# EAGLE board ComputeCalculator_V1_0 (EAGLE 7.1.0)
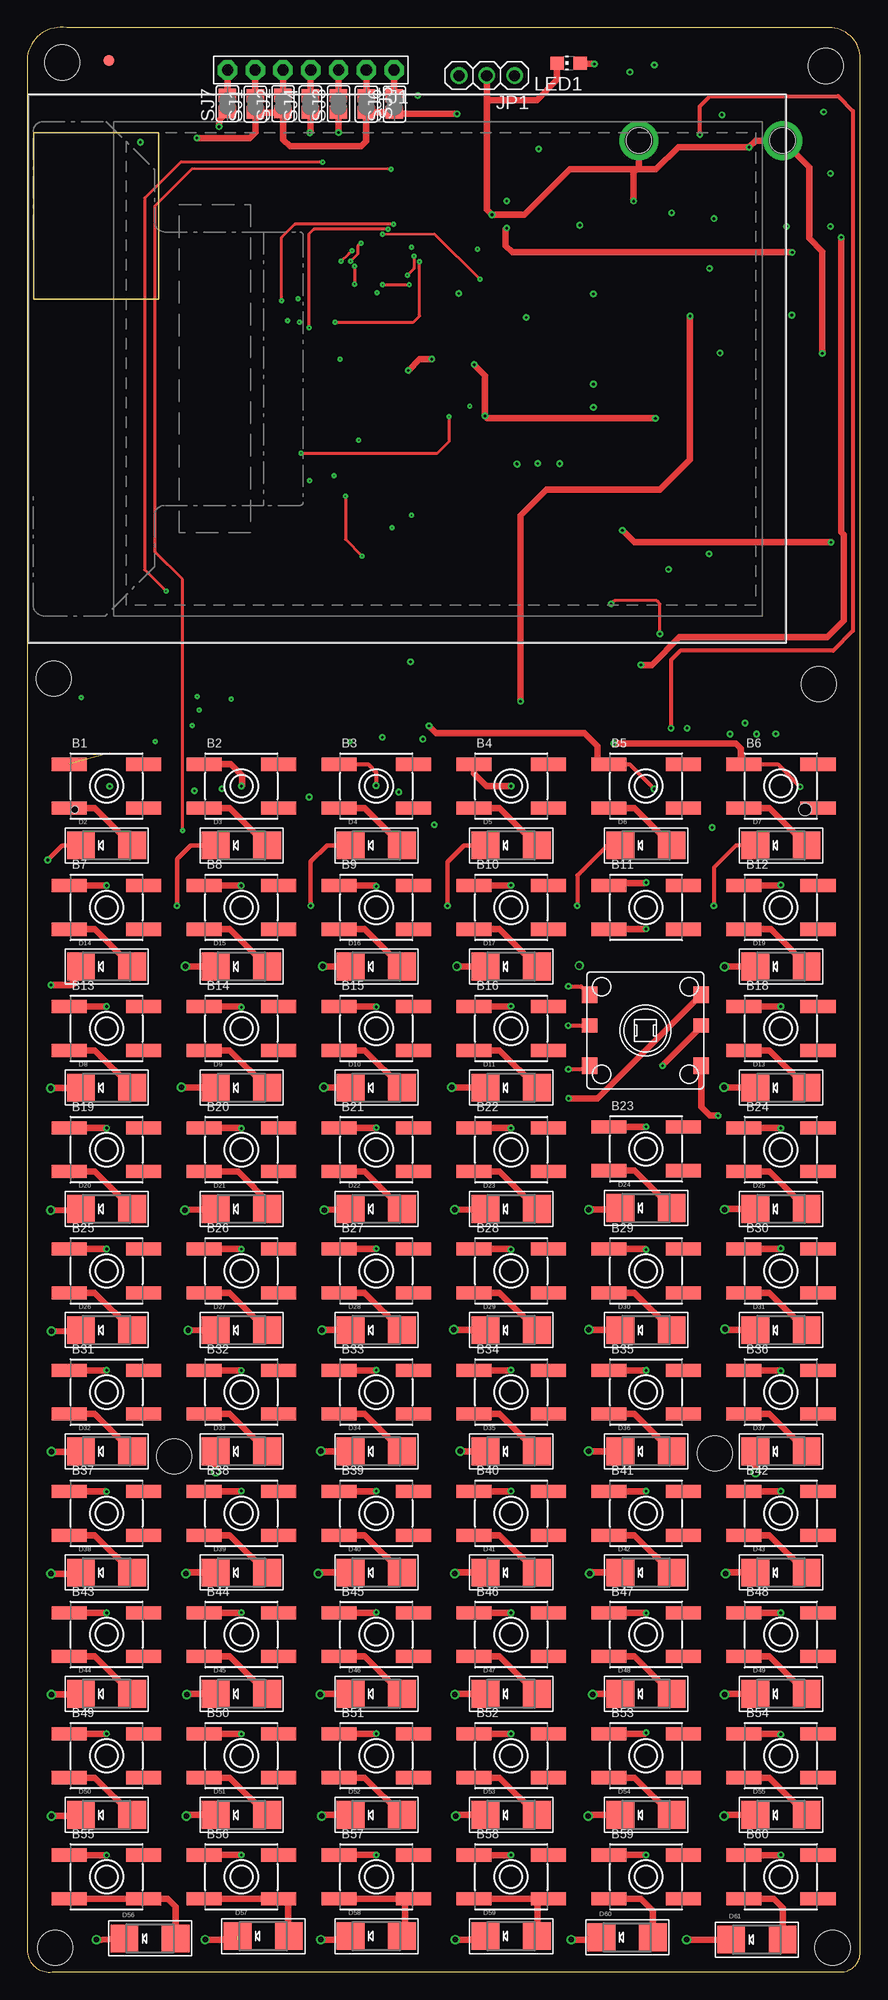
[diagram p5: board, top side]
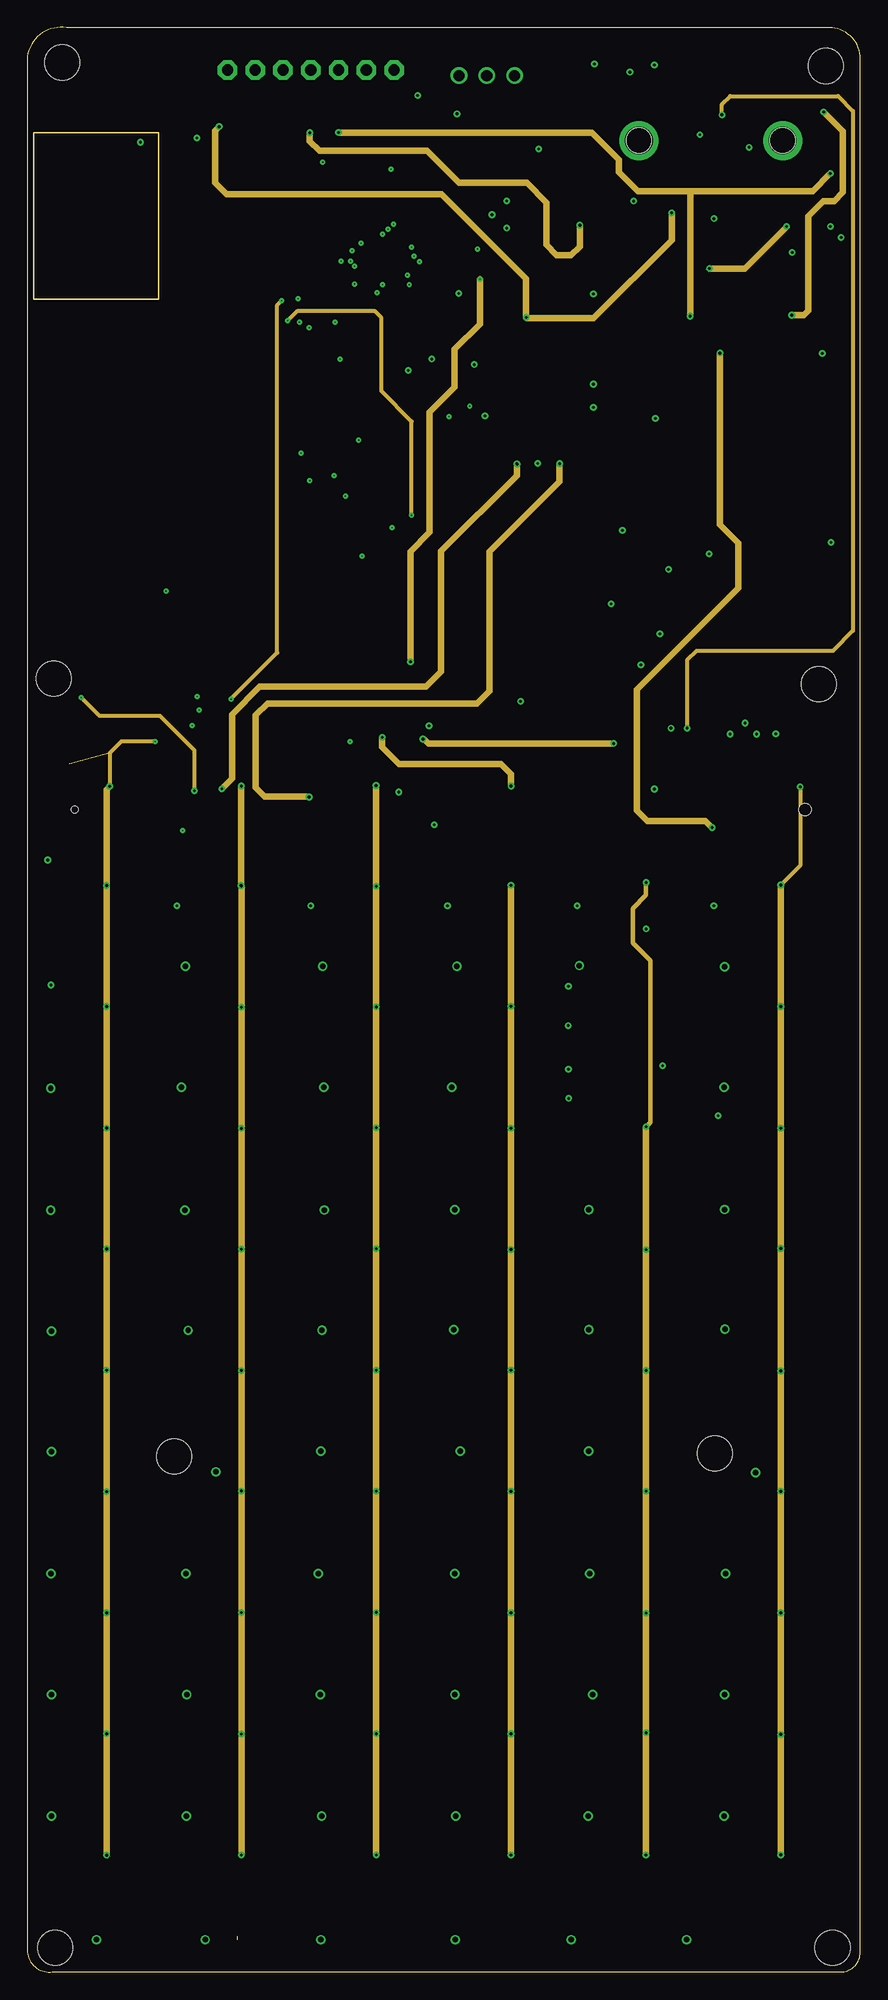
[diagram p6: board, inner layer Route3]
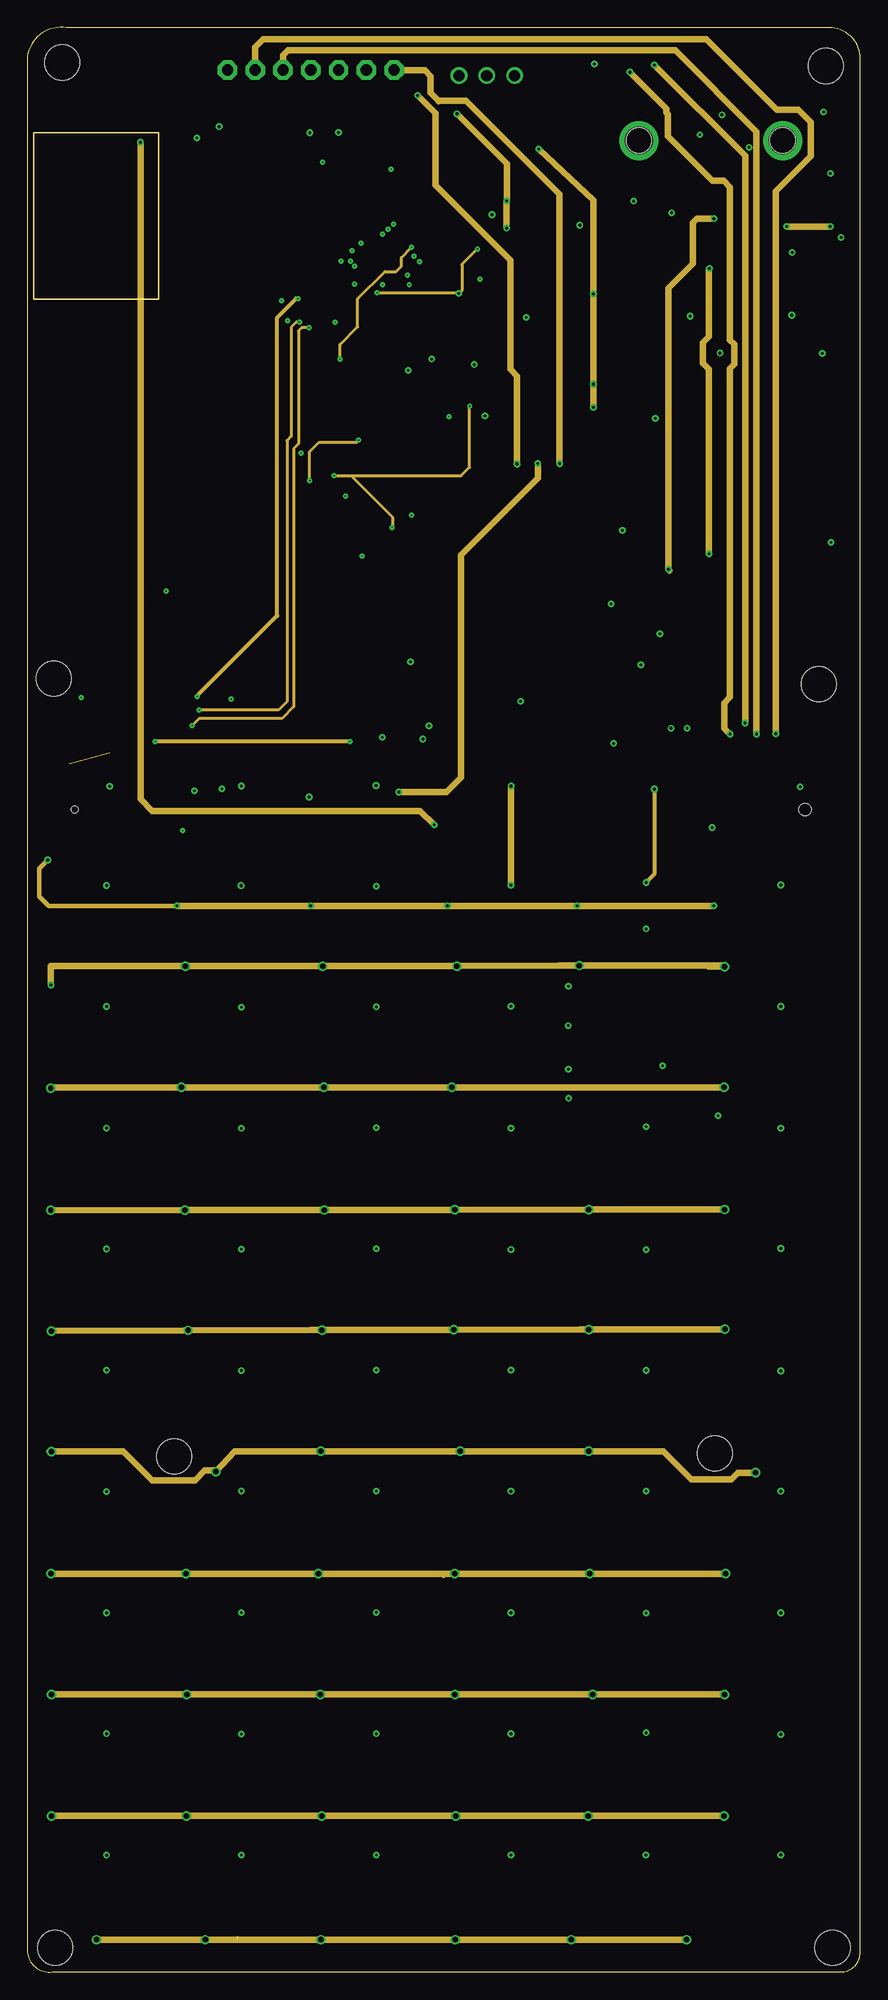
[diagram p7: board, inner layer Route4]
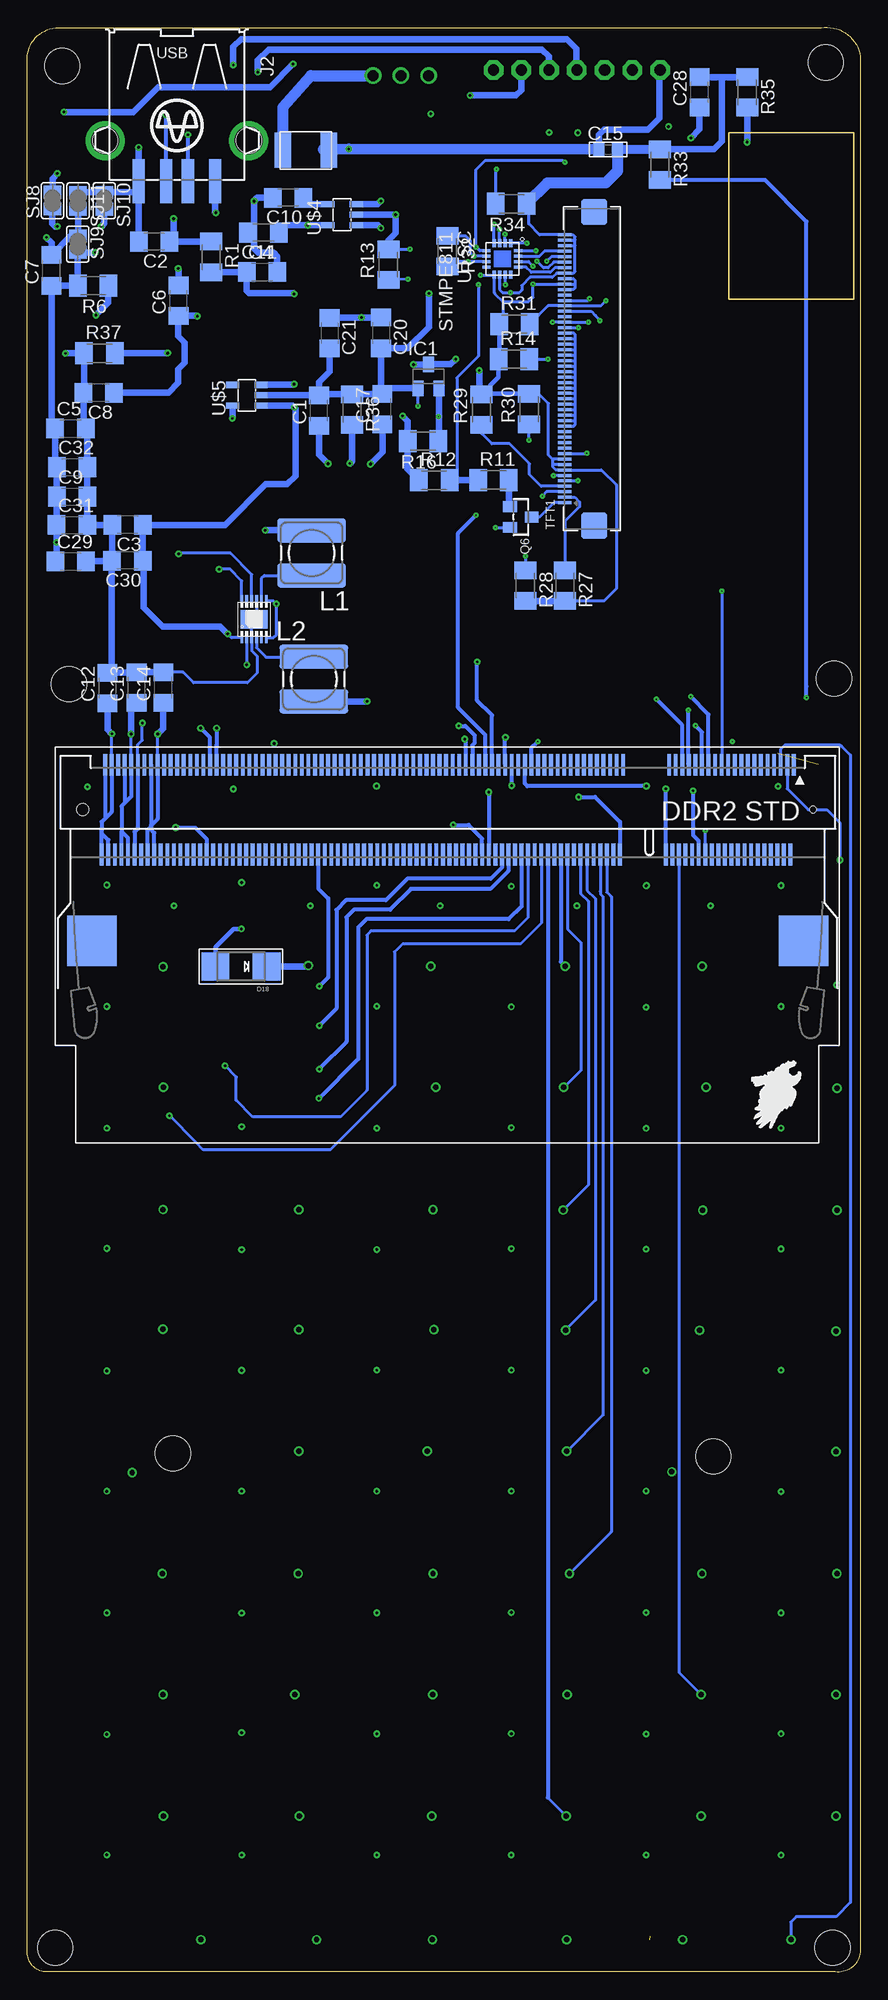
[diagram p8: board, bottom side, seen from below]

Size 76.2 x 177.85 mm. Coordinates in mm from the lower left corner, seen from the top.
Outline: 73.36,177.81 3.59,177.81 arc90 0,175.22 0,1.8 arc90 2.29,0.01 74.4,0.01 arc90 76.2,1.81 76.2,174.97 arc90 73.36,177.81
Copper layers (1*3*4*16): Top 0.0356mm / dielectric 0.5mm / Route3 0.0356mm / dielectric 0.5mm / Route4 0.0356mm / dielectric 0.5mm / Bottom 0.0356mm
Design rules "OSHPARK_LaenPCBOrder *": minimum track width 6mil, minimum drill 13mil, track to track 6mil, track to pad 6mil, pad to pad 6mil, via to via 6mil, smd to smd 6mil, copper to edge 15mil, drill to drill 6mil, minimum pad ring 7mil, minimum via ring 7mil, stop-mask expansion 3mil, vias tented up to drill 0mil, thermal gap 10mil
Holes 3.2 mm at 3.17,174.64 73.03,174.32 2.54,2.24 73.66,2.24 2.4,118.31 13.44,47.16 62.88,47.43 72.39,117.81

## Footprints (pad centres in the part's own frame; a part is rotated, then mirrored left to right if it is on the bottom)
EVQ-Q2 = smd 3.2 x 1.2: A -3.4,-2; A' 3.4,-2; B -3.4,2; B' 3.4,2
SKQU = smd 1.4 x 1.5: 1 -5.1,3.25; 3 -5.1,-3.25; 4 5.1,-3.25; 6 5.1,3.25 | smd 1.4 x 1.3: 2 -5.1,-0.45; 5 5.1,-0.45
C1206 = smd 1.6 x 1.8: 1 -1.4,0; 2 1.4,0
C0603 = smd 1 x 1.1: 1 -0.85,0; 2 0.85,0
SMADIODE = smd 2.54 x 2.54: A 2.349,0; C -2.349,0
SOT23 = smd 1 x 1.4: 1 -0.95,-1.1; 2 0.95,-1.1; 3 0,1.1
1X7-BIG = drill 1.016 pad 1.778 octagon: 1 -7.62,0; 2 -5.08,0; 3 -2.54,0; 4 0,0; 5 2.54,0; 6 5.08,0; 7 7.62,0
USB-A003 = smd 1.12 x 4: 1 -3.5,14; 2 -1,14; 3 1,14; 4 3.5,14 | hole 2.3: -6.57,10.28; 6.57,10.28
1X03 = drill 1.016: 1 -2.54,0; 2 0,0; 3 2.54,0
POWER-CHOKE_WE-TPC = smd 6.3 x 2.2: 1 0,2.05; 2 0,-2.05
CHIP-LED0805 = smd 1.2 x 1.2: A 0,-1.05; C 0,1.05
RPI_COMPUTE = smd 0.35 x 2: 1 -31.38,-4.1; 2 -31.08,4.1; 3 -30.78,-4.1; 4 -30.48,4.1; 5 -30.18,-4.1; 6 -29.88,4.1; 7 -29.58,-4.1; 8 -29.28,4.1; 9 -28.98,-4.1; 10 -28.68,4.1; 11 -28.38,-4.1; 12 -28.08,4.1; 13 -27.78,-4.1; 14 -27.48,4.1; 15 -27.18,-4.1; 16 -26.88,4.1; 17 -26.58,-4.1; 18 -26.28,4.1; 19 -25.98,-4.1; 20 -25.68,4.1; 21 -25.38,-4.1; 22 -25.08,4.1; 23 -24.78,-4.1; 24 -24.48,4.1; 25 -24.18,-4.1; 26 -23.88,4.1; 27 -23.58,-4.1; 28 -23.28,4.1; 29 -22.98,-4.1; 30 -22.68,4.1; 31 -22.38,-4.1; 32 -22.08,4.1; 33 -21.78,-4.1; 34 -21.48,4.1; 35 -21.18,-4.1; 36 -20.88,4.1; 37 -20.58,-4.1; 38 -20.28,4.1; 39 -19.98,-4.1; 40 -19.68,4.1; 41 -15.78,-4.1; 42 -15.48,4.1; 43 -15.18,-4.1; 44 -14.88,4.1; 45 -14.58,-4.1; 46 -14.28,4.1; 47 -13.98,-4.1; 48 -13.68,4.1; 49 -13.38,-4.1; 50 -13.08,4.1; 51 -12.78,-4.1; 52 -12.48,4.1; 53 -12.18,-4.1; 54 -11.88,4.1; 55 -11.58,-4.1; 56 -11.28,4.1; 57 -10.98,-4.1; 58 -10.68,4.1; 59 -10.38,-4.1; 60 -10.08,4.1; 61 -9.78,-4.1; 62 -9.48,4.1; 63 -9.18,-4.1; 64 -8.88,4.1; 65 -8.58,-4.1; 66 -8.28,4.1; 67 -7.98,-4.1; 68 -7.68,4.1; 69 -7.38,-4.1; 70 -7.08,4.1; 71 -6.78,-4.1; 72 -6.48,4.1; 73 -6.18,-4.1; 74 -5.88,4.1; 75 -5.58,-4.1; 76 -5.28,4.1; 77 -4.98,-4.1; 78 -4.68,4.1; 79 -4.38,-4.1; 80 -4.08,4.1; 81 -3.78,-4.1; 82 -3.48,4.1; 83 -3.18,-4.1; 84 -2.88,4.1; 85 -2.58,-4.1; 86 -2.28,4.1; 87 -1.98,-4.1; 88 -1.68,4.1; 89 -1.38,-4.1; 90 -1.08,4.1; 91 -0.78,-4.1; 92 -0.48,4.1; 93 -0.18,-4.1; 94 0.12,4.1; 95 0.42,-4.1; 96 0.72,4.1; 97 1.02,-4.1; 98 1.32,4.1; 99 1.62,-4.1; 100 1.92,4.1; 101 2.22,-4.1; 102 2.52,4.1; 103 2.82,-4.1; 104 3.12,4.1; 105 3.42,-4.1; 106 3.72,4.1; 107 4.02,-4.1; 108 4.32,4.1; 109 4.62,-4.1; 110 4.92,4.1; 111 5.22,-4.1; 112 5.52,4.1; 113 5.82,-4.1; 114 6.12,4.1; 115 6.42,-4.1; 116 6.72,4.1; 117 7.02,-4.1; 118 7.32,4.1; 119 7.62,-4.1; 120 7.92,4.1; 121 8.22,-4.1; 122 8.52,4.1; 123 8.82,-4.1; 124 9.12,4.1; 125 9.42,-4.1; 126 9.72,4.1; 127 10.02,-4.1; 128 10.32,4.1; 129 10.62,-4.1; 130 10.92,4.1; 131 11.22,-4.1; 132 11.52,4.1; 133 11.82,-4.1; 134 12.12,4.1; 135 12.42,-4.1; 136 12.72,4.1; 137 13.02,-4.1; 138 13.32,4.1; 139 13.62,-4.1; 140 13.92,4.1; 141 14.22,-4.1; 142 14.52,4.1; 143 14.82,-4.1; 144 15.12,4.1; 145 15.42,-4.1; 146 15.72,4.1; 147 16.02,-4.1; 148 16.32,4.1; 149 16.62,-4.1; 150 16.92,4.1; 151 17.22,-4.1; 152 17.52,4.1; 153 17.82,-4.1; 154 18.12,4.1; 155 18.42,-4.1; 156 18.72,4.1; 157 19.02,-4.1; 158 19.32,4.1; 159 19.62,-4.1; 160 19.92,4.1; 161 20.22,-4.1; 162 20.52,4.1; 163 20.82,-4.1; 164 21.12,4.1; 165 21.42,-4.1; 166 21.72,4.1; 167 22.02,-4.1; 168 22.32,4.1; 169 22.62,-4.1; 170 22.92,4.1; 171 23.22,-4.1; 172 23.52,4.1; 173 23.82,-4.1; 174 24.12,4.1; 175 24.42,-4.1; 176 24.72,4.1; 177 25.02,-4.1; 178 25.32,4.1; 179 25.62,-4.1; 180 25.92,4.1; 181 26.22,-4.1; 182 26.52,4.1; 183 26.82,-4.1; 184 27.12,4.1; 185 27.42,-4.1; 186 27.72,4.1; 187 28.02,-4.1; 188 28.32,4.1; 189 28.62,-4.1; 190 28.92,4.1; 191 29.22,-4.1; 192 29.52,4.1; 193 29.82,-4.1; 194 30.12,4.1; 195 30.42,-4.1; 196 30.72,4.1; 197 31.02,-4.1; 198 31.32,4.1; 199 31.62,-4.1; 200 31.92,4.1 | smd 4.5 x 4.6: M1 -32.28,12; M2 32.82,12 | hole 0.6: -33.13,0 | hole 1.1: 33.67,0
SOT23-WIDE = smd 1 x 1.27: 1 -0.95,-1; 2 0.95,-1; 3 0,1
M1206 = smd 1.6 x 2: 1 -1.4,0; 2 1.4,0
SJW = smd 1.168 x 1.6: 1 -0.762,0; 2 0.762,0
TFT_2.83IN_240X320_50PIN = smd 0.275 x 1.2 bottom: 1 12.25,-10.39; 2 11.75,-10.39; 3 11.25,-10.39; 4 10.75,-10.39; 5 10.25,-10.39; 6 9.75,-10.39; 7 9.25,-10.39; 8 8.75,-10.39; 9 8.25,-10.39; 10 7.75,-10.39; 11 7.25,-10.39; 12 6.75,-10.39; 13 6.25,-10.39; 14 5.75,-10.39; 15 5.25,-10.39; 16 4.75,-10.39; 17 4.25,-10.39; 18 3.75,-10.39; 19 3.25,-10.39; 20 2.75,-10.39; 21 2.25,-10.39; 22 1.75,-10.39; 23 1.25,-10.39; 24 0.75,-10.39; 25 0.25,-10.39; 26 -0.25,-10.39; 27 -0.75,-10.39; 28 -1.25,-10.39; 29 -1.75,-10.39; 30 -2.25,-10.39; 31 -2.75,-10.39; 32 -3.25,-10.39; 33 -3.75,-10.39; 34 -4.25,-10.39; 35 -4.75,-10.39; 36 -5.25,-10.39; 37 -5.75,-10.39; 38 -6.25,-10.39; 39 -6.75,-10.39; 40 -7.25,-10.39; 41 -7.75,-10.39; 42 -8.25,-10.39; 43 -8.75,-10.39; 44 -9.25,-10.39; 45 -9.75,-10.39; 46 -10.25,-10.39; 47 -10.75,-10.39; 48 -11.25,-10.39; 49 -11.75,-10.39; 50 -12.25,-10.39 | smd 2.4 x 2.4 bottom: PAD1 14.35,-13.09; PAD2 -14.35,-13.09
WDFN_12L = smd 1 x 0.25: 1 -1.7,1.125; 2 -1.7,0.675; 3 -1.7,0.225; 4 -1.7,-0.225; 5 -1.7,-0.675; 6 -1.7,-1.125; 7 1.7,-1.125; 8 1.7,-0.675; 9 1.7,-0.225; 10 1.7,0.225; 11 1.7,0.675; 12 1.7,1.125 | smd 1.7 x 2.5: 13 0,0
FIDUCIAL_1MM = smd 1 x 1: 1 0,0
MF-MSMF200 = smd 1.5 x 3.2: P$1 -2.1,0; P$2 2.1,0
SOT-25 = smd 0.55 x 1.2: 1 -0.95,-1.3; 2 0,-1.3; 3 0.95,-1.3; 4 0.95,1.3; 5 -0.95,1.3
QFN16L = smd 0.75 x 0.3: 1 -1.45,0.75; 2 -1.45,0.25; 3 -1.45,-0.25; 4 -1.45,-0.75; 9 1.45,-0.75; 10 1.45,-0.25; 11 1.45,0.25; 12 1.45,0.75 | smd 0.3 x 0.75: 5 -0.75,-1.45; 6 -0.25,-1.45; 7 0.25,-1.45; 8 0.75,-1.45; 13 0.75,1.45; 14 0.25,1.45; 15 -0.25,1.45; 16 -0.75,1.45

## Placement (x,y rotation side)
B1  A0  [EVQ-Q2]  7.25,108.46 0 top
B2  B0  [EVQ-Q2]  19.58,108.46 0 top
B3  C0  [EVQ-Q2]  31.92,108.46 0 top
B4  D0  [EVQ-Q2]  44.26,108.46 0 top
B5  E0  [EVQ-Q2]  56.6,108.46 0 top
B6  F0  [EVQ-Q2]  68.93,108.46 0 top
B7  A1  [EVQ-Q2]  7.25,97.38 0 top
B8  B1  [EVQ-Q2]  19.58,97.38 0 top
B9  C1  [EVQ-Q2]  31.92,97.38 0 top
B10  D1  [EVQ-Q2]  44.26,97.38 0 top
B11  E1  [EVQ-Q2]  56.6,97.38 0 top
B12  F1  [EVQ-Q2]  68.93,97.38 0 top
B13  A2  [EVQ-Q2]  7.25,86.29 0 top
B14  B2  [EVQ-Q2]  19.58,86.29 0 top
B15  C2  [EVQ-Q2]  31.92,86.29 0 top
B16  D2  [EVQ-Q2]  44.26,86.29 0 top
B17  SKQU  [SKQU]  56.53,86.12 180 top
B18  F2  [EVQ-Q2]  68.93,86.29 0 top
B19  A3  [EVQ-Q2]  7.25,75.21 0 top
B20  B3  [EVQ-Q2]  19.58,75.21 0 top
B21  C3  [EVQ-Q2]  31.92,75.21 0 top
B22  D3  [EVQ-Q2]  44.26,75.21 0 top
B23  E3  [EVQ-Q2]  56.6,75.29 0 top
B24  F3  [EVQ-Q2]  68.93,75.21 0 top
B25  A4  [EVQ-Q2]  7.25,64.13 0 top
B26  B4  [EVQ-Q2]  19.58,64.13 0 top
B27  C4  [EVQ-Q2]  31.92,64.13 0 top
B28  D4  [EVQ-Q2]  44.26,64.13 0 top
B29  E4  [EVQ-Q2]  56.6,64.13 0 top
B30  F4  [EVQ-Q2]  68.93,64.13 0 top
B31  A5  [EVQ-Q2]  7.25,53.04 0 top
B32  B5  [EVQ-Q2]  19.58,53.04 0 top
B33  C5  [EVQ-Q2]  31.92,53.04 0 top
B34  D5  [EVQ-Q2]  44.26,53.04 0 top
B35  E5  [EVQ-Q2]  56.6,53.04 0 top
B36  F5\  [EVQ-Q2]  68.93,53.04 0 top
B37  A6  [EVQ-Q2]  7.25,41.96 0 top
B38  B6  [EVQ-Q2]  19.58,41.96 0 top
B39  C6  [EVQ-Q2]  31.92,41.96 0 top
B40  D6  [EVQ-Q2]  44.26,41.96 0 top
B41  E6  [EVQ-Q2]  56.6,41.96 0 top
B42  F6  [EVQ-Q2]  68.93,41.96 0 top
B43  A7  [EVQ-Q2]  7.25,30.88 0 top
B44  B7  [EVQ-Q2]  19.58,30.88 0 top
B45  C7  [EVQ-Q2]  31.92,30.88 0 top
B46  D7  [EVQ-Q2]  44.26,30.88 0 top
B47  E7  [EVQ-Q2]  56.6,30.88 0 top
B48  F7  [EVQ-Q2]  68.93,30.88 0 top
B49  A8  [EVQ-Q2]  7.25,19.79 0 top
B50  B8  [EVQ-Q2]  19.58,19.79 0 top
B51  C8  [EVQ-Q2]  31.92,19.79 0 top
B52  D8  [EVQ-Q2]  44.26,19.79 0 top
B53  E8  [EVQ-Q2]  56.6,19.79 0 top
B54  F8  [EVQ-Q2]  68.93,19.79 0 top
B55  A9  [EVQ-Q2]  7.25,8.71 0 top
B56  B9  [EVQ-Q2]  19.58,8.71 0 top
B57  C9  [EVQ-Q2]  31.92,8.71 0 top
B58  D9  [EVQ-Q2]  44.26,8.71 0 top
B59  E9  [EVQ-Q2]  56.6,8.71 0 top
B60  F9  [EVQ-Q2]  68.93,8.71 0 top
C1  1uF  [C1206]  49.51,142.8 90 bottom
C2  100nF  [C1206]  64.61,158.25 180 bottom
C3  10uF  [C1206]  67.02,132.35 180 bottom
C4  10uF  [C1206]  54.74,155.49 0 bottom
C5  10uF  [C1206]  72.25,141.18 0 bottom
C6  NF  [C1206]  62.36,152.86 90 bottom
C7  NF  [C1206]  73.99,155.62 90 bottom
C8  10uF  [C1206]  69.66,144.42 180 bottom
C9  1uF  [C1206]  72.11,134.93 0 bottom
C10  100nF  [C1206]  52.34,162.26 180 bottom
C11  4.7uF  [C1206]  54.61,159.07 180 bottom
C12  47uF  [C1206]  68.86,117.43 90 bottom
C13  47uF  [C1206]  66.19,117.46 90 bottom
C14  47uF  [C1206]  63.76,117.47 90 bottom
C15  47uF  [C0603]  23.06,166.68 0 bottom
C17  1uF  [C1206]  43.72,142.92 90 bottom
C20  47uF  [C1206]  43.84,149.9 270 bottom
C21  47uF  [C1206]  48.55,149.89 270 bottom
C28  10uF  [C1206]  14.71,171.91 90 bottom
C29  0.1uF  [C1206]  72.22,129.02 0 bottom
C30  10uF  [C1206]  67.04,129.07 180 bottom
C31  0.1uF  [C1206]  72.12,132.34 0 bottom
C32  0.1uF  [C1206]  72.11,137.63 0 bottom
D2  [SMADIODE]  7.25,103.05 0 top
D3  [SMADIODE]  19.58,103.05 0 top
D4  [SMADIODE]  31.92,103.05 0 top
D5  [SMADIODE]  44.26,103.05 0 top
D6  [SMADIODE]  56.6,103.05 0 top
D7  [SMADIODE]  68.93,103.05 0 top
D8  [SMADIODE]  7.25,80.88 0 top
D9  [SMADIODE]  19.58,80.88 0 top
D10  [SMADIODE]  31.92,80.88 0 top
D11  [SMADIODE]  44.26,80.88 0 top
D13  [SMADIODE]  68.93,80.88 0 top
D14  [SMADIODE]  7.25,91.97 0 top
D15  [SMADIODE]  19.58,91.97 0 top
D16  [SMADIODE]  31.92,91.97 0 top
D17  [SMADIODE]  44.26,91.97 0 top
D18  [SMADIODE]  56.66,91.97 180 bottom
D19  [SMADIODE]  68.93,91.97 0 top
D20  [SMADIODE]  7.25,69.8 0 top
D21  [SMADIODE]  19.58,69.8 0 top
D22  [SMADIODE]  31.92,69.8 0 top
D23  [SMADIODE]  44.26,69.8 0 top
D24  [SMADIODE]  56.6,69.88 0 top
D25  [SMADIODE]  68.93,69.8 0 top
D26  [SMADIODE]  7.25,58.71 0 top
D27  [SMADIODE]  19.58,58.71 0 top
D28  [SMADIODE]  31.92,58.71 0 top
D29  [SMADIODE]  44.26,58.71 0 top
D30  [SMADIODE]  56.6,58.71 0 top
D31  [SMADIODE]  68.93,58.71 0 top
D32  [SMADIODE]  7.25,47.63 0 top
D33  [SMADIODE]  19.58,47.63 0 top
D34  [SMADIODE]  31.92,47.63 0 top
D35  [SMADIODE]  44.26,47.63 0 top
D36  [SMADIODE]  56.6,47.63 0 top
D37  [SMADIODE]  68.93,47.63 0 top
D38  [SMADIODE]  7.25,36.55 0 top
D39  [SMADIODE]  19.58,36.55 0 top
D40  [SMADIODE]  31.92,36.55 0 top
D41  [SMADIODE]  44.26,36.55 0 top
D42  [SMADIODE]  56.6,36.55 0 top
D43  [SMADIODE]  68.93,36.55 0 top
D44  [SMADIODE]  7.25,25.46 0 top
D45  [SMADIODE]  19.58,25.46 0 top
D46  [SMADIODE]  31.92,25.46 0 top
D47  [SMADIODE]  44.26,25.46 0 top
D48  [SMADIODE]  56.6,25.46 0 top
D49  [SMADIODE]  68.93,25.46 0 top
D50  [SMADIODE]  7.25,14.38 0 top
D51  [SMADIODE]  19.58,14.38 0 top
D52  [SMADIODE]  31.92,14.38 0 top
D53  [SMADIODE]  44.26,14.38 0 top
D54  [SMADIODE]  56.6,14.38 0 top
D55  [SMADIODE]  68.93,14.38 0 top
D56  [SMADIODE]  11.23,3.09 0 top
D57  [SMADIODE]  21.57,3.3 0 top
D58  [SMADIODE]  31.92,3.3 0 top
D59  [SMADIODE]  44.26,3.3 0 top
D60  [SMADIODE]  54.87,3.19 0 top
D61  [SMADIODE]  66.73,2.98 0 top
IC1  MAXP803  [SOT23]  39.51,145.93 0 bottom
J1  Power  [1X7-BIG]  25.93,173.95 180 top
J2  61400416021  [USB-A003]  62.51,177.78 180 bottom
JP1  [1X03]  42.03,173.44 180 top
L1  SRN4018-4R7M  [POWER-CHOKE_WE-TPC]  50.2,129.78 180 bottom
L2  SRN4018-4R7M  [POWER-CHOKE_WE-TPC]  49.99,118.25 0 bottom
LED1  RED  [CHIP-LED0805]  49.52,174.58 90 top
PCB1  RPI_COMPUTE  [RPI_COMPUTE]  37.47,106.31 180 bottom
Q6  MMBT2222  [SOT23-WIDE]  31.06,133.07 270 bottom
R1  100KΩ 1%  [M1206]  59.38,156.85 270 bottom
R6  470Ω 1%  [M1206]  70.19,154.23 180 bottom
R11  1K  [M1206]  33.56,136.45 0 bottom
R12  1K  [M1206]  38.98,136.43 0 bottom
R13  10K  [M1206]  43.17,156.16 90 bottom
R14  10K  [M1206]  31.69,147.5 0 bottom
R16  100  [M1206]  40.01,140 180 bottom
R27  100  [M1206]  27.02,126.8 270 bottom
R28  100  [M1206]  30.64,126.79 270 bottom
R29  100  [M1206]  34.66,142.88 90 bottom
R30  100  [M1206]  30.3,142.94 90 bottom
R31  22  [M1206]  31.63,150.71 0 bottom
R32  22  [M1206]  37.78,157.39 270 bottom
R33  100KΩ 1%  [M1206]  18.33,165.28 270 bottom
R34  100KΩ 1%  [M1206]  31.93,161.71 180 bottom
R35  100KΩ 1%  [M1206]  10.35,171.9 270 bottom
R36  100KΩ 1%  [M1206]  46.5,142.88 270 bottom
R37  100KΩ 1%  [M1206]  69.6,148.04 0 bottom
SJ1  [SJW]  20.85,170.83 90 top
SJ2  [SJW]  23.39,170.88 90 top
SJ3  [SJW]  28.47,170.86 90 top
SJ4  [SJW]  25.89,170.84 90 top
SJ5  [SJW]  31.01,170.83 270 top
SJ6  [SJW]  33.58,170.83 90 top
SJ7  [SJW]  18.3,170.88 90 top
SJ8  [SJW]  73.9,162 90 bottom
SJ9  [SJW]  71.58,158.02 270 bottom
SJ10  [SJW]  69.16,161.99 270 bottom
SJ11  [SJW]  71.56,161.99 270 bottom
TFT1  DISP_LCD_2.8IN_240X320_50PIN  [TFT_2.83IN_240X320_50PIN]  37.44,146.63 270 top
U$1  PAM2306AYPKE  [WDFN_12L]  55.45,123.72 90 bottom
U$2  FIDUCIAL  [FIDUCIAL_1MM]  7.47,174.81 0 top
U$3  MF-MSMF200  [MF-MSMF200]  50.72,166.59 0 bottom
U$4  AP7115-25SEG  [SOT-25]  47.41,160.71 90 bottom
U$5  MIC5225  [SOT-25]  56.13,144.2 90 bottom
UTSC  STMPE811  [QFN16L]  32.74,156.67 270 bottom

## Tracks (layer width: path | path; a pad name or v marks a point on that pad's centre or on a via)
1V8  (via drill 0.25)
  Top 0.61: SJ3.1 v28.47,168.23 | v45.12,116.22 45.12,133.2 47.48,135.56 57.86,135.56 60.62,138.32 60.62,151.42 v60.64,151.44
  Route3 0.61: v28.47,168.23 51.64,168.23 54.13,165.74 54.13,164.6 55.85,162.88 60.6,162.88 | 60.6,162.88 71.83,162.86 v73.46,164.49 | v60.64,151.44 60.64,162.84 60.6,162.88
  Bottom 0.61: v73.46,164.49 73.4,164.51 73.9,164.01 SJ8.2 | C8.1 68.23,144.45 63.29,144.45 62.4,145.34 62.4,146.6 61.81,147.19 61.81,148.99 62.41,149.59 62.41,151.41 C6.1 60.66,151.46 v60.64,151.44 | L2.2 45.14,116.2 v45.12,116.22
3V3  (via drill 0.25)
  Top 0.61: v15.5,167.73 20.33,167.73 20.86,168.26 20.86,170.06 | 20.86,170.06 SJ1.1 | 20.86,170.06 23.33,170.06 SJ2.1 23.39,167.55 24.02,166.98 30.51,166.96 30.97,167.42 30.97,170.03 SJ5.2 SJ6.1 33.71,169.94 v39.3,169.94 | v69.97,157.27 44.39,157.27 43.76,157.9 43.76,159.4 v43.85,159.49 | v73.53,130.76 55.53,130.76 v54.44,131.85
  Route4 0.61: v43.85,161.97 43.87,161.96 43.87,165.37 v39.3,169.94 | v43.85,161.98 v43.85,161.97 | v43.85,161.97 v43.85,159.49
  Bottom 0.61: C28.1 14.71,168.52 v15.5,167.73 | U$4.1 44.12,159.76 v43.85,159.49 | U$4.3 44.17,161.66 v43.85,161.98 | v69.97,157.27 69.98,157.26 SJ9.2 71.59,157.25 R6.2 C7.1 73.99,141.52 C5.1 73.65,137.77 C32.1 C9.1 C31.1 | C31.1 73.52,129.12 C29.1 | C31.1 v73.52,130.77 v73.53,130.76 | v54.44,131.85 50.22,131.85 L1.2
5V  (via drill 0.25)
  Top 0.254: v57.87,122.38 57.87,125.12 57.57,125.42 53.71,125.42 v53.41,125.12
  Top 0.61: SJ7.2 18.3,174.35 J1.7
  Route4 0.61: v51.79,143.1 v51.79,145.22 v51.79,153.47 51.79,162.05 v46.78,166.72
  Bottom 0.254: U$1.6 53.68,122.02 53.41,122.29 v53.41,125.12 53.69,125.4 54.31,125.4 U$1.7 | U$1.1 57.51,122.02 v57.87,122.38
  Bottom 0.61: C15.1 23.91,168.01 23.44,168.48 19.43,168.48 18.38,169.53 18.38,174.29 J1.7 | U$5.1 51.94,143.25 v51.79,143.1 51.68,142.99 51.68,136.82 52.44,136.06 54.39,136.06 58.1,132.35 C3.1 | U$5.3 51.86,145.15 v51.79,145.22 | R1.2 56.18,155.45 C4.1 56.14,153.76 55.9,153.52 51.84,153.52 v51.79,153.47 | C30.1 65.64,132.33 C3.1 | C3.1 65.79,132.35 65.83,132.31 65.83,131.83 65.63,131.63 65.63,129.21 65.55,129.13 65.55,124.78 63.84,123.07 58.56,123.07 v57.87,122.38
  Bottom 1.016: C15.1 v46.78,166.72 49.12,166.68 U$3.P$2
A  (via drill 0.25)
  Top 0.61: v63.2,78.32 62.43,78.32 61.64,79.11 B17.1
  Bottom 0.254: PCB1.66 29.19,95.92 31.08,94.03 41.87,94.03 42.61,93.29 42.61,81.07 48.49,75.19 60.1,75.19 60.81,75.9 60.81,75.93 v63.2,78.32
B  (via drill 0.25)
  Top 0.61: B17.2 61.63,86.41 v58.12,82.9
  Bottom 0.254: PCB1.70 30.39,96.46 31.63,95.22 44.76,95.22 45.14,94.84 45.14,80.64 47.56,78.22 55.59,78.22 57.12,79.75 57.12,81.77 57.1,81.79 57.1,81.88 v58.12,82.9
C  (via drill 0.25)
  Top 0.61: v49.53,79.9 52.16,79.9 B17.3
  Bottom 0.35: PCB1.72 30.99,97.47 32.17,96.29 45.19,96.29 45.94,95.54 45.94,83.49 v49.53,79.9
CENTER  (via drill 0.25)
  Top 0.35: v49.5,82.57 51.13,82.57 B17.6
  Bottom 0.35: PCB1.76 32.19,100.71 33.84,99.06 41.12,99.06 43.02,97.16 46.32,97.16 47,96.48 47,85.07 v49.5,82.57
CM_1V8  (via drill 0.25)
  Top 0.61: J1.3 SJ3.2
  Route4 0.61: v55.12,173.75 58.48,170.39 58.48,170.04 58.6,169.92 58.6,167.89 62.68,163.81 63.7,163.81 64.28,163.23 64.28,149.26 64.66,148.88 64.66,147.04 64.27,146.65 64.27,116.58 C14.1 63.76,113.74 v64.28,113.22
  Bottom 0.254: PCB1.183 v64.29,113.21 v64.28,113.22
  Bottom 0.35: PCB1.186 65.19,104.42 65,104.61 | PCB1.185 64.89,104.86 | 64.89,104.86 64.89,104.72 65,104.61 | PCB1.183 64.29,105.46 64.89,104.86 | PCB1.184 64.59,104.19 65,104.61
  Bottom 0.61: v55.12,173.75 55.12,174.84 54.14,175.82 29.12,175.82 28.49,175.19 28.49,173.97 J1.3 | C14.1 63.76,113.74 v64.28,113.22
CM_3V3  (via drill 0.25)
  Top 0.61: J1.5 SJ2.2
  Route4 0.61: v66.71,113.22 66.71,168.32 59.28,175.75 23.86,175.75 23.39,175.28 J1.5
  Bottom 0.254: PCB1.191 66.69,113.2 v66.71,113.22
  Bottom 0.35: PCB1.194 67.59,104.15 | 67.59,104.15 67.61,104.17 | PCB1.193 67.29,106.92 | 67.29,106.92 67.58,106.63 67.58,104.3 | 67.58,104.3 67.58,104.16 67.59,104.15 | PCB1.191 66.69,107.52 67.29,106.92 | PCB1.192 66.99,103.71 67.58,104.3
  Bottom 0.61: C13.1 66.19,116.04 66.71,115.52 v66.71,113.22
CM_VBAT  (via drill 0.25)
  Top 0.61: J1.6 SJ1.2
  Route4 0.61: J1.6 20.83,174.38 20.83,176.05 21.55,176.77 62.12,176.77 68.58,170.31 70.52,170.31 71.68,169.15 71.68,166.06 68.47,162.85 v68.47,113.24
  Bottom 0.254: PCB1.197 68.49,113.22 v68.47,113.24
  Bottom 0.35: PCB1.200 69.39,104.14 | 69.39,104.14 69.39,104.41 69.4,104.42 69.4,105.18 69.09,105.49 | PCB1.199 69.09,105.49 | PCB1.197 68.49,106.09 69.09,105.49 | PCB1.198 68.79,103.54 69.39,104.14
  Bottom 0.61: C12.1 68.86,113.63 v68.47,113.24
CM_VDAC  (via drill 0.25)
  Top 0.61: J1.4 25.93,171.65 SJ4.2
  Route4 0.61: v65.67,114.22 65.67,166.09 v57.36,174.4
  Bottom 0.254: PCB1.189 66.09,112.25 65.69,112.65 65.69,114.2 v65.67,114.22
  Bottom 0.35: PCB1.189 66.09,104.56 66.39,104.26 PCB1.190
  Bottom 0.61: J1.4 25.96,173.98 25.96,175.9 26.83,176.77 56.65,176.77 57.36,176.06 v57.36,174.4
COL_0  (via drill 0.1, 0.25)  (1 unrouted)
  Top 0.61: B55.B 7.24,10.71 v7.25,10.69 | B1.B | B49.B 7.24,21.79 v7.25,21.8 | B43.B v7.24,32.88 v7.25,32.86 | B37.B 7.24,43.96 v7.25,43.94 | B31.B v7.25,55.04 | B25.B v7.24,66.13 v7.25,66.13 | B19.B 7.24,77.21 v7.25,77.19 | B13.B 7.24,88.29 v7.25,88.3 | B7.B v7.25,99.38 v7.25,99.37
  Route3 0.35: v7.53,108.43 v7.54,108.44 7.54,111.5 8.59,112.55 v11.7,112.55
  Route3 0.61: v7.25,10.69 v7.25,21.8 v7.25,32.86 v7.25,43.94 v7.25,55.04 v7.25,66.13 v7.25,77.19 v7.25,88.3 v7.25,99.37 | v7.25,99.38 7.25,108.15 v7.53,108.43
  Route4 0.35: v29.51,112.55 v11.7,112.55
  Bottom 0.35: PCB1.69 30.09,111.97 v29.51,112.55
COL_1  (via drill 0.25)
  Top 0.61: v19.59,10.71 B56.B | B8.B v19.55,99.38 v19.59,99.33 | B14.B 19.53,88.29 v19.59,88.23 | B20.B 19.55,77.21 v19.59,77.16 | B26.B v19.59,66.13 v19.59,66.12 | B32.B 19.57,55.04 v19.59,55.02 | B38.B 19.55,43.96 v19.59,44 | B44.B v19.59,32.88 v19.59,32.87 | B50.B v19.58,21.79 v19.59,21.78 | B2.B 18.61,110.46 19.63,109.44 19.63,108.52 v19.57,108.46
  Route3 0.61: v19.59,99.33 v19.59,88.23 v19.59,77.16 v19.59,66.12 v19.59,55.02 v19.59,44 v19.59,32.87 v19.59,21.78 v19.59,10.71 | v19.55,99.38 19.55,108.44 v19.57,108.46
  Bottom 0.35: v19.57,108.46 30.45,108.46 30.69,108.7 PCB1.71
COL_2  (via drill 0.25)
  Top 0.35: B3.B 31.16,110.46 31.9,109.72 v31.9,108.51
  Top 0.61: v31.93,10.71 B57.B | B51.B 31.91,21.79 v31.92,21.8 | B45.B 31.9,32.88 v31.92,32.89 | B39.B 31.89,43.96 v31.92,43.99 | B33.B 31.91,55.04 v31.92,55.05 | B27.B 31.88,66.13 v31.92,66.16 | B21.B 31.89,77.21 v31.92,77.23 | B15.B 31.9,88.29 v31.92,88.27 | B9.B 31.85,99.38 v31.92,99.3
  Route3 0.61: v31.93,10.71 v31.92,10.72 v31.92,21.8 v31.92,32.89 v31.92,43.99 v31.92,55.05 v31.92,66.16 v31.92,77.23 v31.92,88.27 v31.92,99.3 31.9,99.32 v31.9,108.51
  Bottom 0.35: PCB1.75 v31.89,108.52 v31.9,108.51
COL_3  (via drill 0.25)
  Top 0.61: B58.B v44.23,10.71 v44.24,10.71 | B4.B 40.86,109.62 42.02,108.45 v44.24,108.45 v44.25,108.46 | B10.B 44.22,99.38 v44.24,99.39 | B16.B 44.21,88.29 v44.24,88.32 | B22.B 44.22,77.21 44.24,77.23 v44.24,77.18 | B28.B 44.2,66.13 v44.24,66.08 | B34.B 44.23,55.04 v44.24,55.05 | B40.B 44.23,43.96 v44.24,43.97 | B46.B 44.23,32.88 v44.24,32.86 | B52.B v44.24,21.79
  Route3 0.61: v44.24,10.71 v44.24,21.79 v44.24,32.86 v44.24,43.97 v44.24,55.05 v44.24,66.08 v44.24,77.18 v44.24,88.32 v44.24,99.39 | v32.46,112.92 32.46,112.01 33.99,110.48 43.32,110.48 44.25,109.55 v44.25,108.46
  Route4 0.61: v44.25,108.46 v44.25,99.4 v44.24,99.39
  Bottom 0.35: PCB1.77 32.49,112.89 v32.46,112.92
COL_4  (via drill 0.25)
  Top 0.35: B5.B 55.09,110.46 v57.36,108.19
  Top 0.61: v56.59,10.71 B59.B | B53.B 56.5,21.79 v56.6,21.89 | B47.B 56.55,32.88 v56.6,32.82 | B41.B 56.56,43.96 v56.6,43.99 | B35.B v56.59,55.04 v56.6,55.03 | B29.B 56.54,66.13 v56.6,66.06 | B23.B 56.59,77.29 v56.6,77.3 | B11.B 53.2,99.52 53.1,99.61 56.57,99.61 v56.6,99.64 | B5.B 52.3,110.46 52.16,110.6 52.16,112.12 50.95,113.33 37.38,113.33 v36.74,113.97
  Route3 0.406: v56.6,99.64 56.6,98.49 55.39,97.28 55.39,94.09 56.98,92.5 56.98,77.68 v56.6,77.3
  Route3 0.61: v56.6,77.3 v56.6,66.06 v56.6,55.03 v56.6,43.99 v56.6,32.82 v56.6,21.89 v56.6,10.72 v56.59,10.71
  Route4 0.35: v57.36,108.19 57.36,100.4 v56.6,99.64
  Bottom 0.35: v36.74,113.97 36.13,113.97 35.28,113.12 35.28,112.42 35.49,112.21 PCB1.87
COL_5  (via drill 0.25)
  Top 0.35: B6.B 68.63,110.46 v70.7,108.39
  Top 0.61: B60.B 68.91,10.71 v68.93,10.72 | B6.B 65.25,110.74 65.25,111.91 64.8,112.36 v53.63,112.36 | B12.B 68.89,99.38 v68.93,99.41 | B18.B 68.91,88.29 v68.93,88.31 | B24.B 68.91,77.21 v68.93,77.18 | B30.B 68.87,66.13 v68.93,66.18 | B36.B 68.87,55.04 v68.93,54.98 | B42.B 68.92,43.96 v68.93,43.97 | B48.B 68.91,32.88 v68.93,32.85 | B54.B 68.88,21.79 v68.93,21.74
  Route3 0.35: v70.7,108.39 70.7,101.18 v68.93,99.41
  Route3 0.61: v68.93,10.72 v68.93,21.74 v68.93,32.85 v68.93,43.97 v68.93,54.98 v68.93,66.18 v68.93,77.18 v68.93,88.31 v68.93,99.41 | v36.19,112.76 36.29,112.76 36.7,112.35 v53.62,112.35 v53.63,112.36
  Bottom 0.35: PCB1.89 36.09,112.66 v36.19,112.76
COMMON  (via drill 0.25)
  Top 0.35: v49.5,90.15 50.65,90.15 B17.4
  Bottom 0.35: PCB1.134 49.59,99.1 48.68,98.19 48.68,90.97 v49.5,90.15
D  (via drill 0.25)
  Top 0.35: v49.48,86.56 B17.5
  Bottom 0.35: PCB1.78 32.79,101 33.8,99.99 41.44,99.99 43.39,98.04 47.03,98.04 47.92,97.15 47.92,88.12 v49.48,86.56
DAC_2V5  (via drill 0.25)
  Top 0.61: SJ4.1 25.89,168.26 v25.84,168.21
  Route3 0.61: v25.84,168.21 25.84,167.45 26.74,166.55 36.57,166.55 39.5,163.62 45.69,163.62 47.48,161.83 47.48,157.96 48.42,157.02 49.75,157.02 50.54,157.81 v50.54,159.76
  Bottom 0.61: U$4.5 v50.54,159.76 52.52,159.76 C11.1
DCIN
  Bottom 1.016: U$3.P$1 52.82,170.54 50.26,173.43 44.63,173.43 JP1.1
GND  (via drill 0.1, 0.25, 2.55)
  Top 0.61: JP1.2 42.03,171.38 | 42.03,171.38 42.03,161.19 v42.51,160.71 45.49,160.71 49.64,164.86 55.77,164.86 | 55.98,164.86 57.52,164.86 59.54,166.88 v66.02,166.88 66.64,167.5 v69.09,167.5 71.51,165.08 71.51,158.56 72.72,157.35 v72.72,148.02 | 55.98,164.86 55.77,164.86 | v55.46,161.96 55.46,164.55 55.77,164.86 | LED1.C 48.47,173.04 46.62,171.19 42.22,171.19 42.03,171.38 | v55.94,167.5 55.94,165.27 55.98,164.86
  Route4 0.254: v28.07,136.85 29.62,136.85 | 29.62,136.85 33.4,133.07 33.4,132.12 v33.38,132.1 | 29.62,136.85 39.69,136.85 40.46,137.62 v40.46,143.2 v40.47,143.21 | v41.19,157.58 41.15,157.58 39.75,156.18 39.75,153.81 v39.46,153.52 32.08,153.52 v32,153.6
  Bottom 0.254: UTSC.10 32.99,153.86 32.73,153.6 v32,153.6 31.2,153.6 30.97,153.83 30.97,154.23 30.22,154.98 28.17,154.98 27.77,155.38 TFT1.43 26.25,155.38 26.1,155.53 26.1,157.91 | R34.1 30.33,161.51 30.33,159.87 29.34,158.88 TFT1.50 26.29,158.88 26.1,158.69 26.1,158.39 | TFT1.6 28.05,136.88 v28.07,136.85 | v33.38,132.1 32.08,132.1 Q6.2 | v40.47,143.21 IC1.1 | R13.2 41.21,157.56 v41.19,157.58 | C14.2 61.95,118.87 60.99,117.91 56.07,117.91 55.17,118.81 55.17,120.34 55.68,120.85 U$1.3 55.68,123.5 U$1.13 55.23,123.95 U$1.9 | 26.1,157.91 26.1,158.39 | TFT1.49 26.11,158.38 26.1,158.39 | TFT1.48 26.14,157.88 26.1,157.91
  Bottom 0.61: R35.1 12.62,173.3 | 12.62,173.3 C28.2 | 18.31,166.7 13.4,166.7 12.66,167.44 12.66,173.26 12.62,173.3 | C1.2 48.74,144.32 46.54,144.32 R36.1 46.46,144.32 C17.2 | v39.46,153.52 39.46,150.45 41.41,148.5 C20.2 43.84,144.44 C17.2 | U$5.2 C1.2 | 48.88,144.2 C1.2 | U$4.2 v42.51,160.71 42.51,159.04 43.17,158.38 R13.2 | 66.01,162.76 SJ10.1 SJ11.1 | 66.01,162.75 J2.4 | 66.01,162.76 v66.01,166.88 v66.02,166.88 | C10.2 55.16,162.26 v55.46,161.96 55.46,159.62 | 55.46,159.62 C11.2 | C2.2 66.01,162.75 | 66.01,162.75 66.01,162.76 | 55.46,159.62 55.46,157.61 55.07,157.22 53.69,157.22 53.34,156.87 C4.2 | C14.2 C13.2 68.83,118.86 C12.2 68.49,119.2 68.49,129.02 | IC1.1 43.21,144.83 C17.2 | C21.2 48.55,146.36 49.49,145.42 49.49,144.22 C1.2 | v72.72,148.02 72.7,148.04 R37.1 71,144.48 C8.2 71.06,141.39 C5.2 70.71,141.04 C32.2 C9.2 C31.2 | C29.2 68.49,129.02 | 68.49,129.02 C30.2 68.44,132.33 C3.2 C31.2 | C31.2
  Bottom 0.813: 18.31,166.7 R33.1 C15.2
  Bottom 1.016: C15.2 22.21,164.7 23.3,163.61 28.63,163.61 R34.1
GPIO0-27_VREF  (via drill 0.25)
  Top 0.61: J1.2 SJ5.1
  Route3 0.61: v44.77,137.94 44.77,136.86 37.85,129.94 37.85,118.93 36.48,117.56 21.26,117.56 18.72,115.02 18.72,109.14 v17.79,108.21
  Route4 0.61: v44.81,137.9 44.81,145.96 44.18,146.59 44.18,156.56 37.33,163.41 37.33,169.99 v35.7,171.62
  Bottom 0.35: PCB1.40 v17.79,108.21
  Bottom 0.61: v35.7,171.62 31.48,171.62 31.01,172.09 J1.2 | C17.1 43.72,138.99 v44.77,137.94 v44.81,137.9
GPIO28-45_VREF  (via drill 0.25)
  Top 0.61: J1.1 33.55,171.63 SJ6.2
  Route3 0.61: v48.69,137.95 48.69,136.32 42.26,129.89 42.26,117.13 41.14,116.01 21.96,116.01 20.89,114.94 20.89,108.32 21.72,107.49 25.74,107.49 v25.77,107.46
  Route4 0.61: v48.69,137.95 48.69,162.58 40.14,171.13 37.66,171.13 37.62,171.09 37.62,171.13 36.9,171.85 36.9,173.39 36.36,173.93 33.56,173.93 J1.1
  Bottom 0.35: v25.77,107.46 24.27,107.46 21.99,105.18 PCB1.42
  Bottom 0.61: 48.75,138.01 v48.69,137.95 49.51,138.77 C1.1
MISO  (via drill 0.1)
  Top 0.254: v32.99,159.38 26.2,159.38 25.79,158.97 v25.79,150.38
  Route4 0.254: v25.8,150.38 25.09,150.38 24.81,150.09 24.81,139.77 24.37,139.33 24.37,115.72 23.29,114.64 15.73,114.64 v15.07,113.98
  Bottom 0.254: UTSC.3 v32.99,159.38 | TFT1.33 v25.8,150.38 v25.79,150.38
  Bottom 0.35: 15.02,113.94 v15.06,113.98 v15.07,113.98 14.49,113.4 PCB1.29
MOSI  (via drill 0.1)
  Top 0.254: v28.14,150.88 35.33,150.88 35.89,151.44 35.89,156.39 v35.88,156.42
  Route4 0.254: v24.89,150.88 24.59,150.88 24.14,150.42 24.14,140.46 23.74,140.06 23.74,116.19 22.98,115.43 15.74,115.43 v15.72,115.41
  Bottom 0.254: UTSC.7 v35.88,156.42 | v35.88,156.42 37.35,156.42 R32.2 | v28.15,150.88 v28.14,150.88 TFT1.34 v24.89,150.88 | v35.87,156.42 v35.88,156.42
  Bottom 0.305: 15.72,110.44 PCB1.33
  Bottom 0.35: 15.72,110.44 v15.72,115.41
N$1  (via drill 0.25)
  Top 0.254: v56.13,119.55 56.32,119.55 56.33,119.54
  Top 0.61: v74.45,158.63 74.45,131.7 74.69,131.46 74.69,123.61 73.17,122.09 59.67,122.09 57.12,119.54 56.33,119.54 v56.14,119.54 v56.13,119.55
  Bottom 0.254: U$1.2 v56.13,119.55
  Bottom 0.61: SJ11.2 71.56,158.81 SJ9.1 72.23,158.79 C7.2 73.99,158.17 v74.45,158.63
N$2  (via drill 0.25)
  Top 0.61: v51.88,174.51 50.64,174.51 LED1.A
  Route3 0.61: v69.93,151.53 71.05,151.53 71.45,151.93 71.45,160.57 72.83,161.95 73.8,161.95 74.6,162.75 74.6,168.35 v72.85,170.1
  Bottom 0.61: R6.1 68.79,152.67 v69.93,151.53 | v72.85,170.1 66.51,170.1 64.22,172.39 54,172.39 v51.88,174.51
N$3  (via drill 0.25)
  Route4 0.61: v62.81,160.36 61.26,160.36 60.9,160 60.9,156.24 58.65,153.99 v58.65,128.28 58.74,128.19
  Bottom 0.254: U$1.12 56.58,127.23 57.64,128.29 v58.64,128.29 v58.65,128.28
  Bottom 0.61: C2.1 R1.1 62.76,158.25 62.81,158.3 v62.81,160.36
N$5  (via drill 0.25)
  Route3 0.61: v62.4,155.8 65.62,155.8 v69.46,159.64
  Route4 0.61: v69.46,159.64 v73.46,159.64 | v62.4,155.8 62.36,155.76 62.36,149.57 61.78,148.99 61.78,147.16 62.36,146.58 v62.36,129.69
  Bottom 0.254: U$1.10 55.68,127.81 57.62,129.75 62.3,129.75 v62.36,129.69
  Bottom 0.61: SJ10.2 69.16,159.94 v69.46,159.64 | v73.46,159.64 73.67,159.64 73.91,159.88 73.91,161.23 SJ8.1 | C6.2 62.36,155.76 v62.4,155.8
N$6
  Bottom 0.254: U$1.8 54.78,127.46 54.51,127.73 L1.1
N$7
  Bottom 0.254: U$1.4 55.23,121.12 54.36,120.25 50.04,120.25 L2.1
N$8
  Bottom 0.254: TFT1.1 28.02,134.38 29.33,133.07 Q6.3
N$9
  Bottom 0.61: U$4.4 50.34,161.66 C10.1
N$11  (via drill 0.1)
  Top 0.254: v32.48,154.32 34.92,154.32 v34.94,154.3
  Bottom 0.254: UTSC.11 v32.49,154.33 v32.48,154.32 | v34.94,154.3 34.94,147.78 36.91,145.81 36.91,137.1 R12.2
  Bottom 0.61: R11.1 37.56,136.45 R12.2
N$12
  Bottom 0.61: R11.2 32.16,134.12 Q6.1
N$19  (via drill 0.1)
  Top 0.254: v33.28,164.89 15.06,164.91 11.7,161.55 11.7,129.88 14.19,127.39 v14.19,104.38
  Bottom 0.254: R34.2 33.33,164.84 v33.28,164.89 | PCB1.28 v14.19,104.38
N$23
  Top 0.61: B6.A 67.87,106.46 D7.A
N$24  (via drill 0.25)
  Route4 0.61: v46.69,137.97 46.69,136.62 39.67,129.6 39.67,109.24 38.34,107.91 v34,107.91 v33.99,107.92
  Bottom 0.35: v33.99,107.92 PCB1.82
  Bottom 0.61: R36.2 46.5,138.16 v46.69,137.97
N$25  (via drill 0.25)
  Route4 0.61: v10.35,167.34 10.35,107.26 11.41,106.2 35.94,106.2 v37.23,104.91
  Bottom 0.35: v37.23,104.91 35.84,104.91 34.59,103.66 PCB1.84
  Bottom 0.61: R35.2 v10.35,167.34
N$26
  Bottom 0.254: TFT1.2 26.12,134.88 25.69,134.44 25.69,134 27,132.69 27,128.22 R27.1
N$27  (via drill 0.1)
  Top 0.254: v29.09,134.98 29.09,131.04 v30.63,129.5
  Bottom 0.254: TFT1.3 28.7,135.38 v29.09,134.98 | v30.63,129.5 R28.1
N$28
  Bottom 0.254: TFT1.4 29.2,135.88 30.25,136.93 30.25,137.94 32.08,139.77 33.71,139.77 34.63,140.69 34.63,141.45 R29.1
N$29  (via drill 0.1)
  Route4 0.254: v25.84,136.41 25.84,139.05 26.69,139.9 30.12,139.9 v30.32,140.1
  Bottom 0.254: TFT1.5 25.88,136.38 v25.84,136.41 | v30.32,140.1 30.32,141.52 R30.1
N$30  (via drill 0.25)
  Route3 0.61: v63.36,148.06 63.36,132.39 65.06,130.69 65.06,126.55 55.78,117.27 55.78,106.21 56.72,105.27 62.03,105.27 v62.63,104.67
  Bottom 0.35: v62.63,104.67 60.84,104.67 59.81,103.64 59.81,102.23 PCB1.168
  Bottom 0.61: R37.2 63.38,148.04 v63.36,148.06
N$31  (via drill 0.1, 0.25)
  Route3 0.35: v15.29,108.03 15.29,111.72 12.13,114.88 6.6,114.88 v4.92,116.56
  Bottom 0.35: R33.2 8.71,163.87 4.92,160.08 4.92,117.58 v4.92,116.56 | PCB1.30 14.79,103.45 15.28,103.94 v15.28,108.02 v15.29,108.03
N$32
  Bottom 0.254: TFT1.15 26.23,141.38 26.07,141.53 26.07,141.79 | 26.07,141.79 26.07,142.28 | 26.07,142.28 26.07,142.96 | 26.07,142.96 26.07,143.38 | 26.07,143.38 26.07,143.9 | 26.07,143.9 26.07,144.45 | 26.07,144.45 26.07,144.8 | 26.07,144.8 26.07,145.39 | 26.07,145.39 26.07,145.82 | 26.07,145.82 26.07,146.43 | 26.07,146.43 26.07,146.8 | 26.07,146.8 26.07,147.39 | 26.07,147.39 26.07,147.75 | 26.07,147.75 26.07,148.31 | 26.07,148.31 26.07,148.88 | 26.07,148.88 26.07,149.25 | 26.07,149.25 26.07,149.73 26.21,149.87 TFT1.32 | TFT1.31 26.2,149.38 26.07,149.25 | TFT1.30 26.07,148.88 | TFT1.29 26.14,148.38 26.07,148.31 | TFT1.28 26.2,147.88 26.07,147.75 | TFT1.27 26.09,147.38 26.07,147.39 | TFT1.26 26.14,146.88 26.07,146.8 | TFT1.25 26.12,146.38 26.07,146.43 | TFT1.24 26.12,145.88 26.07,145.82 | TFT1.23 26.09,145.38 26.07,145.39 | TFT1.22 26.14,144.88 26.07,144.8 | TFT1.21 26.14,144.38 26.07,144.45 | TFT1.20 26.09,143.88 26.07,143.9 | TFT1.19 26.07,143.38 | TFT1.18 26.16,142.88 26.07,142.96 | TFT1.17 26.16,142.38 26.07,142.28 | TFT1.16 26.16,141.88 26.07,141.79
N$40
  Top 0.61: B2.A 18.52,106.46 D3.A
N$41
  Top 0.61: B3.A 30.86,106.46 D4.A
N$42
  Top 0.61: B1.A 6.18,106.46 D2.A
N$44
  Top 0.61: B4.A 43.2,106.46 D5.A
N$45
  Top 0.61: B5.A 55.53,106.46 D6.A
N$52
  Top 0.61: B13.A 6.18,84.29 D8.A
N$53
  Top 0.61: B18.A 67.87,84.29 D13.A
N$54
  Top 0.61: B14.A 18.52,84.29 D9.A
N$55
  Top 0.61: B15.A 30.86,84.29 D10.A
N$56
  Top 0.61: B16.A 43.2,84.29 D11.A
N$57
  Top 0.61: B23.A 55.53,73.29 D24.A
N$64
  Top 0.61: B7.A 6.18,95.38 D14.A
N$65
  Top 0.61: B12.A 68,95.38 71.82,91.55 71.82,91.61 71.63,91.61 D19.A
N$66
  Top 0.61: B8.A 18.52,95.38 D15.A
N$67
  Top 0.61: B9.A 30.86,95.38 D16.A
N$68
  Top 0.61: B10.A 43.2,95.38 D17.A
N$69  (via drill 0.25 pad 0.25)
  Top 0.61: B11.A 56.57,95.38 v56.61,95.4
  Bottom 0.406: v56.61,95.4 57.32,95.4 58.98,93.74 58.98,92 D18.A
  Bottom 0.61: 58.06,92.92 D18.A
N$76
  Top 0.61: B19.A 6.18,73.21 D20.A
N$77
  Top 0.61: B24.A 67.87,73.21 D25.A
N$78
  Top 0.61: B20.A 19.27,73.21 22.31,70.16 22.3,70.16 D21.A
N$79
  Top 0.61: B21.A 30.86,73.21 D22.A
N$80
  Top 0.61: B22.A 43.2,73.21 D23.A
N$88
  Top 0.61: B25.A 6.18,62.13 D26.A
N$89
  Top 0.61: B30.A 67.87,62.13 D31.A
N$90
  Top 0.61: B26.A 18.51,62.13 22.31,58.32 22.31,58.34 D27.A
N$91
  Top 0.61: B27.A 30.86,62.13 D28.A
N$92
  Top 0.61: B28.A 43.2,62.13 D29.A
N$93
  Top 0.61: B29.A 55.53,62.13 D30.A
N$100
  Top 0.61: B31.A 6.18,51.04 D32.A
N$101
  Top 0.61: B36.A 67.87,51.04 D37.A
N$102
  Top 0.61: B32.A 18.52,51.04 D33.A
N$103
  Top 0.61: B33.A 30.86,51.04 D34.A
N$104
  Top 0.61: B34.A 43.2,51.04 D35.A
N$105
  Top 0.61: B35.A 55.53,51.04 D36.A
N$112
  Top 0.61: B37.A 6.18,39.96 D38.A
N$113
  Top 0.61: B42.A 67.87,39.96 D43.A
N$114
  Top 0.61: B38.A 18.52,39.96 D39.A
N$115
  Top 0.61: B39.A 30.86,39.96 D40.A
N$116
  Top 0.61: B40.A 43.2,39.96 D41.A
N$117
  Top 0.61: B41.A 55.53,39.96 D42.A
N$124
  Top 0.61: B43.A 6.18,28.88 D44.A
N$125
  Top 0.61: B48.A 67.87,28.88 D49.A
N$126
  Top 0.61: B44.A 18.52,28.88 D45.A
N$127
  Top 0.61: B45.A 30.86,28.88 D46.A
N$128
  Top 0.61: B46.A 43.2,28.88 D47.A
N$129
  Top 0.61: B47.A 55.53,28.88 D48.A
N$136
  Top 0.61: B49.A 6.18,17.79 D50.A
N$137
  Top 0.61: B54.A 67.87,17.79 D55.A
N$138
  Top 0.61: B50.A 18.52,17.79 D51.A
N$139
  Top 0.61: B51.A 30.86,17.79 D52.A
N$140
  Top 0.61: B52.A 43.2,17.79 D53.A
N$141
  Top 0.61: B53.A 55.53,17.79 D54.A
N$148
  Top 0.61: B55.A B55.A' 12.86,6.71 13.59,5.97 13.59,3.1 D56.A
N$149
  Top 0.61: B60.A 68.27,6.71 69.09,5.88 D61.A
N$150
  Top 0.61: B56.A B56.A' 23.66,6.71 23.85,6.51 23.85,3.37 D57.A
N$151
  Top 0.61: B57.A B57.A' 34.67,6.71 34.57,6.8 34.57,3.6 D58.A
N$152
  Top 0.61: B58.A B58.A' 46.73,6.71 46.68,6.65 46.68,3.37 D59.A
N$153
  Top 0.61: B59.A 56.15,6.71 57.24,5.61 57.24,3.21 D60.A
ROW_0  (via drill 0.25 pad 0.25)
  Top 0.35: D7.C 64.83,103.05 62.82,101.03 62.82,97.63 v62.8,97.51 | D6.C 53.05,103.05 50.31,100.3 50.31,97.62 v50.3,97.51
  Top 0.406: D5.C 39.94,103.05 38.43,101.53 v38.43,97.52 v38.44,97.51 | D4.C 27.4,103.05 25.93,101.57 v25.93,97.52 v25.92,97.51 | D3.C 14.93,103.05 13.7,101.81 v13.7,97.52 v13.69,97.51 | D2.C 3.2,103.05 v1.86,101.7
  Top 0.61: D2.C
  Route4 0.406: v13.69,97.51 1.96,97.51 1.1,98.37 1.1,100.94 v1.86,101.7
  Route4 0.61: v62.8,97.51 v50.3,97.51 v38.44,97.51 v25.92,97.51 v13.69,97.51
  Bottom 0.254: PCB1.3 6.69,108.22 4.78,106.31 3.06,106.31 1.87,105.12 v1.87,101.71 v1.86,101.7
ROW_1  (via drill 0.25 pad 0.25, 0.5 pad 0.25)
  Top 0.61: D19.C 63.81,91.97 v63.78,91.93 | 4.88,91.98 D14.C 4.19,91.26 4.19,90.32 4.14,90.27 v2.16,90.27 | D17.C 39.34,91.97 v39.3,92 | D15.C 14.5,91.97 arc-90 v14.46,92 | D16.C 27.05,91.97 arc-90 v27.01,92
  Route4 0.61: 62.31,91.97 v63.78,91.93 63.78,92.05 v50.5,92.05 48.64,92.05 v39.3,92 v27.01,92 v14.46,92 2.16,92 v2.16,90.27
  Bottom 0.254: 27.39,92.38 v27.01,92
  Bottom 0.35: PCB1.60 27.39,92.38
  Bottom 0.61: D18.C 50.58,91.97 v50.5,92.05
ROW_2  (via drill 0.5 pad 0.25)
  Top 0.61: D13.C 63.77,80.88 v63.74,80.91 | v2.14,80.84 4.87,80.85 D8.C | D11.C 41.88,80.91 v38.83,80.91 | D10.C 29.54,80.91 v27.12,80.91 | D9.C 14.13,80.88 arc-90 v14.1,80.91
  Route4 0.61: v63.74,80.91 v38.83,80.91 v27.12,80.91 v14.1,80.91 1.99,80.91 v2.14,80.84
  Bottom 0.254: PCB1.58 26.79,95.37 25.58,94.16 25.58,82.45 v27.12,80.91
ROW_3  (via drill 0.5 pad 0.25)
  Top 0.61: D25.C 63.83,69.8 v63.78,69.74 | v2.14,69.69 4.77,69.67 D20.C | D21.C v14.41,69.69 | D22.C v27.17,69.7 | D23.C v39.09,69.72 | D24.C 54.09,69.73 v51.37,69.73
  Route4 0.61: v63.78,69.74 v51.37,69.73 | v51.37,69.73 51.27,69.73 | 51.27,69.73 v39.09,69.72 | v39.09,69.72 38.98,69.72 | 38.98,69.72 v27.17,69.7 | v27.17,69.7 v14.41,69.69 | v14.41,69.69 2.08,69.67 v2.14,69.69 | v14.41,69.69 14.67,69.69 | v27.17,69.7 27.27,69.7 | v39.09,69.72 | v39.09,69.72 38.98,69.72 | v51.37,69.73 | v51.37,69.73 51.27,69.73
  Bottom 0.254: PCB1.54 25.59,98.63 24.89,97.93 24.89,71.98 v27.17,69.7
ROW_4  (via drill 0.5 pad 0.25)
  Top 0.61: D31.C 63.89,58.71 v63.81,58.79 | v2.21,58.61 4.82,58.63 D26.C | D30.C 51.42,58.71 v51.37,58.77 | D29.C 39.03,58.71 v39,58.74 | D28.C v26.96,58.71 v26.96,58.72 | D27.C v14.71,58.69
  Route4 0.61: v63.81,58.79 v51.37,58.77 | v51.37,58.77 50.61,58.77 | 50.61,58.77 v39,58.74 | v39,58.74 37.76,58.74 | 37.76,58.74 v26.96,58.72 25.96,58.71 v14.71,58.69 14.4,58.69 2.17,58.66 v2.21,58.61 | v51.37,58.77 50.61,58.77 | v39,58.74 37.76,58.74
  Bottom 0.254: PCB1.52 24.99,98.93 24.22,98.16 24.22,61.46 v26.96,58.72
ROW_5  (via drill 0.5 pad 0.25)
  Top 0.61: D37.C 66.58,45.7 v66.61,45.67 | v2.21,47.59 4.86,47.59 D32.C | D33.C 17.23,45.98 v17.24,45.75 | D34.C 27.12,47.63 v26.85,47.63 | D35.C v39.6,47.63 | D36.C v51.36,47.63
  Route4 0.61: v66.61,45.67 65.01,45.67 64.38,45.04 60.76,45.04 58.17,47.63 v51.36,47.63 v39.6,47.63 v26.85,47.63 18.98,47.63 v17.24,45.75 17.23,45.88 16.24,45.88 15.35,44.99 11.42,44.99 8.78,47.63 2,47.63 v2.21,47.59
  Bottom 0.254: PCB1.48 23.79,98.84 23.76,98.81 23.76,98.57 23.53,98.34 23.53,50.95 v26.85,47.63
ROW_6  (via drill 0.5 pad 0.25)
  Top 0.61: D43.C 63.96,36.55 v63.86,36.44 | v2.15,36.44 4.46,36.42 D38.C | D42.C 51.53,36.55 v51.43,36.44 | D41.C 39.19,36.55 v39.09,36.44 | 26.7,36.44 26.8,36.55 D40.C 26.71,36.55 v26.61,36.44 | D39.C 14.59,36.55 v14.49,36.44
  Route4 0.61: v63.86,36.44 v51.43,36.44 v39.09,36.44 38.22,36.44 | 38.22,36.44 v26.61,36.44 v14.49,36.44 v2.15,36.44 | 38.22,36.44 38.09,36.31
  Bottom 0.254: PCB1.46 23.19,98.77 22.78,98.36 22.78,40.27 v26.61,36.44
ROW_7  (via drill 0.5 pad 0.25)
  Top 0.61: D49.C 63.85,25.46 v63.78,25.39 | v2.22,25.39 4.83,25.39 D44.C | D45.C 14.65,25.46 v14.58,25.39 | D46.C 26.87,25.46 v26.8,25.39 | D47.C 39.19,25.46 v39.12,25.39 | D48.C 51.8,25.46 v51.73,25.39
  Route4 0.61: v63.78,25.39 v51.73,25.39 v39.12,25.39 v26.8,25.39 v14.58,25.39 v2.22,25.39
  Bottom 0.254: PCB1.36 16.59,27.4 v14.58,25.39
ROW_8  (via drill 0.5 pad 0.25)
  Top 0.61: D55.C 63.84,14.38 v63.75,14.28 | v2.22,14.28 4.8,14.28 D50.C | D54.C 51.41,14.38 v51.32,14.28 | D53.C 39.28,14.38 v39.19,14.28 | D52.C 27.02,14.38 v26.92,14.28 | D51.C 14.65,14.38 v14.56,14.28
  Route4 0.61: v63.75,14.28 v51.32,14.28 v39.19,14.28 v26.92,14.28 v14.56,14.28 v2.22,14.28
  Bottom 0.254: 28.59,15.95 v26.92,14.28
  Bottom 0.35: PCB1.64 28.59,15.95
ROW_9  (via drill 0.5 pad 0.25)  (1 unrouted)
  Top 0.406: 52.3,2.96 D60.C
  Top 0.61: D61.C v60.31,2.96 | v6.33,2.96 6.17,2.92 D56.C | 19.23,2.97 v16.27,2.96 | D58.C 29.35,2.96 v26.86,2.96 | D59.C 41.91,2.98 v39.14,2.96 | D60.C 51.61,3.3 | v49.74,2.96 52.3,2.96
  Route4 0.61: v60.31,2.96 v49.74,2.96 v39.14,2.96 v26.86,2.96 v16.27,2.96 v6.33,2.96
  Bottom 0.254: PCB1.5 7.29,111.83 6.88,112.24 1.9,112.24 1.8,112.14 1.73,112.14 0.9,111.31 0.9,6.37 2.2,5.07 5.86,5.07 6.37,4.56 6.37,3 v6.33,2.96
RT_CS_3V  (via drill 0.1)
  Top 0.254: v27.03,165.51 14.01,165.51 10.73,162.23 10.73,128.25 v12.68,126.3
  Route4 0.254: v28.59,147.49 28.59,148.85 30.21,150.47 30.21,153.03 32.7,155.52 33.73,155.52 34.21,156 34.21,156.8 v35.14,157.73
  Bottom 0.254: UTSC.5 34.83,157.42 34.95,157.54 v35.14,157.73 35.14,164.85 34.3,165.69 27.21,165.69 v27.03,165.51 | v12.68,126.3 PCB1.23 | R14.2 v28.6,147.5 v28.59,147.49
RT_INT  (via drill 0.1, 0.25)
  Top 0.254: v32.49,158.94 37.22,158.97 v41.39,154.8
  Route3 0.61: v41.39,154.8 41.39,150.71 39.08,148.4 39.08,144.95 36.81,142.68 36.81,131.67 35.05,129.91 v35.05,119.82
  Bottom 0.254: UTSC.2 v32.49,158.94 | v41.39,154.8 R13.1
  Bottom 0.35: PCB1.81 33.69,114.94 35.05,116.3 v35.05,119.82
SCLK  (via drill 0.1)
  Top 0.254: v33.49,159.84 24.46,159.84 23.26,158.64 v23.26,152.86
  Route3 0.35: v18.65,116.4 18.65,116.45 22.85,120.65 22.85,152.45 v23.26,152.86
  Bottom 0.254: R31.2 28.57,152.38 TFT1.37 23.75,152.38 v23.26,152.86 | UTSC.4 v33.49,159.84
  Bottom 0.35: PCB1.35 16.29,114.04 v18.65,116.4
TFT_3V3  (via drill 0.1, 0.25)
  Top 0.254: v29.94,156.01 v29.94,154.38 | v35.36,156.93 35.36,155.79 v34.76,155.19
  Top 0.61: v37,147.51 35.89,147.51 v34.85,146.47 | v40.87,147.01 41.87,146.01 v41.87,142.31 42.09,142.09 v57.45,142.09
  Bottom 0.254: UTSC.14 30.35,156.42 v29.94,156.01 | 32.69,152.74 33.46,153.51 33.46,153.55 33.49,153.58 UTSC.9 33.52,155.19 v34.76,155.19 | 32.69,152.74 30.36,152.74 29.94,153.16 v29.94,154.38 TFT1.41 26.18,154.38 26.12,154.31 | R32.1 37.76,158.77 36.09,158.77 35.72,158.4 35.72,157.29 v35.36,156.93 v35.35,156.92 UTSC.6 | 32.69,152.74 32.69,151.05 R31.1 | TFT1.9 28.18,138.38 | 28.18,138.38 28.52,138.72 28.52,143.45 29.43,144.36 30.28,144.36 R30.2 | 28.11,137.92 28.11,137.63 27.86,137.38 TFT1.7 23.68,137.38 22.32,136.01 22.32,126.51 23.44,125.39 R27.2 | 28.11,137.92 28.11,138.31 28.18,138.38 | TFT1.8 28.07,137.88 28.11,137.92 | TFT1.42 26.27,154.88 26.12,154.73 26.12,154.31 | 26.12,154.31 26.12,154 26.25,153.87 TFT1.40
  Bottom 0.406: R31.1 33.03,147.56 R14.1 33.09,145.85 R29.2 34.6,144.34 R30.2
  Bottom 0.61: v37,147.51 37.48,147.03 IC1.3 39.53,147.01 v40.87,147.01 | v34.85,146.47 34.85,144.47 R29.2 | R27.2 R28.2 | R12.1 41.41,137.46 R16.2 41.41,141.85 v41.87,142.31 | U$5.5 57.43,142.11 v57.45,142.09
TFT_CS_3V  (via drill 0.1)
  Route4 0.35: v15.52,116.64 15.52,116.72 22.85,124.05 22.85,151.32 24.57,153.04 v24.76,153.04
  Bottom 0.254: TFT1.38 24.93,152.88 v24.76,153.04
  Bottom 0.35: PCB1.27 13.89,115.01 v15.52,116.64
TFT_DC_3V  (via drill 0.1)
  Route3 0.35: v35.16,133.22 35.16,141.8 32.38,144.58 32.38,151.29 31.8,151.87 24.67,151.87 v23.81,151.01
  Bottom 0.254: TFT1.36 24.61,151.88 24.22,151.49 23.81,151.08 v23.81,151.01
  Bottom 0.35: PCB1.83 34.29,113.15 36.8,115.66 36.8,131.58 v35.16,133.22
TFT_RESET  (via drill 0.1)
  Top 0.254: v25.03,138.9 37.51,138.9 R16.1 38.61,142.21 v38.59,142.23
  Bottom 0.254: TFT1.10 25.05,138.88 v25.03,138.9 | v38.59,142.23 38.59,140.02 R16.1
  Bottom 0.61: IC1.2 38.56,140.05 R16.1
USB_DM  (via drill 0.2, 0.25)
  Top 0.35: v61.51,168.02 61.51,170.63 62.44,171.56 74.18,171.56 75.53,170.19 75.53,122.66 73.71,120.84 59.72,120.84 58.88,120 v58.88,113.76
  Bottom 0.35: J2.2 v61.51,168.02 | PCB1.165 58.89,112.19 58.88,112.2 v58.88,113.76
USB_DP  (via drill 0.25)
  Route3 0.35: v63.54,169.85 63.54,170.81 64.29,171.56 74.18,171.56 75.53,170.19 75.53,122.66 73.7,120.83 61.21,120.83 60.35,119.97 v60.35,113.76
  Bottom 0.35: J2.3 63.51,169.82 v63.54,169.85 | PCB1.167 59.49,112.9 v60.35,113.76
VBUSA  (via drill 0.25)
  Top 0.61: v17.55,168.77 17.55,169.37 SJ7.1
  Route3 0.61: v17.55,168.77 17.16,168.38 17.16,163.64 18.21,162.59 37.91,162.59 45.63,154.87 v45.63,151.31 45.71,151.23 51.79,151.23 58.95,158.39 v58.95,160.89
  Bottom 0.61: 48.61,151.23 C21.1 C20.1 v45.62,151.3 v45.63,151.31 | J2.1 59.01,160.95 v58.95,160.89
X+
  Bottom 0.254: TFT1.44 27.91,155.88 28.35,155.44 30.09,155.44 30.57,155.92 UTSC.13
X-  (via drill 0.1)
  Top 0.254: v28.69,156.45 28.72,156.45 29.43,157.16 v29.69,157.42
  Bottom 0.254: TFT1.46 28.27,156.88 v28.69,156.45 | UTSC.16 v29.69,157.42
Y+
  Bottom 0.254: TFT1.47 28.91,157.38 29.36,156.92 UTSC.15
Y-  (via drill 0.1)
  Top 0.254: v29.57,156.45 30.25,157.13 30.25,157.86 v30.51,158.12
  Bottom 0.254: TFT1.45 28.05,156.38 28.57,155.85 28.97,155.85 v29.57,156.45 | v30.51,158.12 UTSC.1